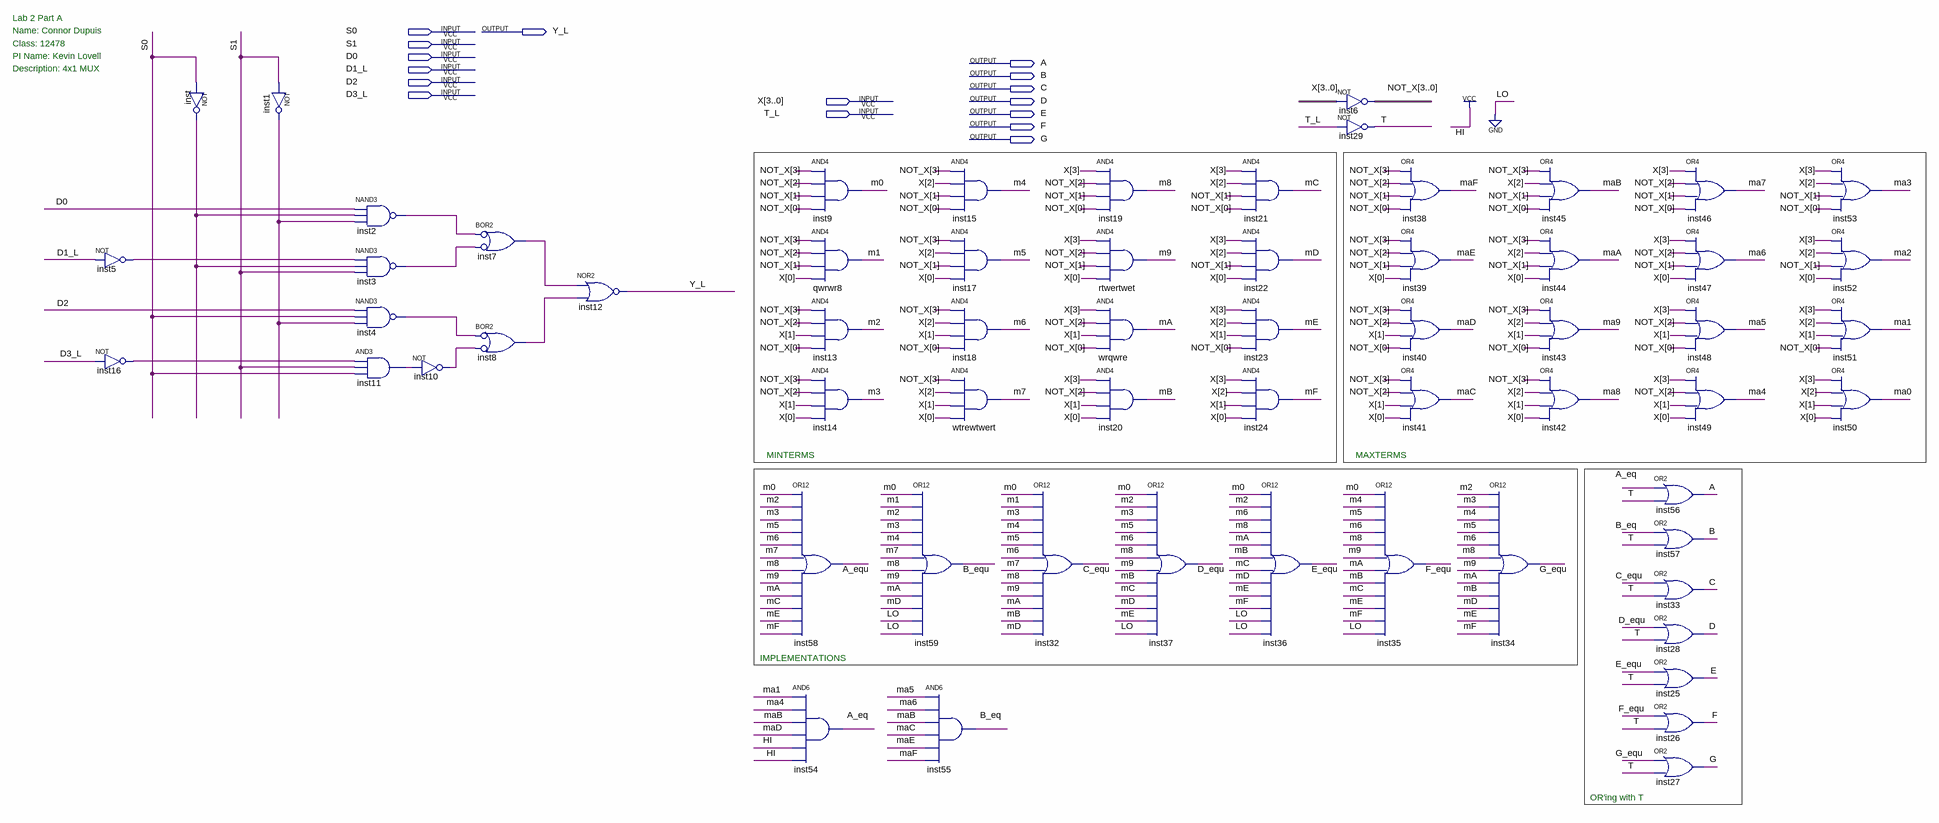
[diagram p0: schematic sheet]
// Quartus schematic Lab2_MUX.bdf as structural Verilog: 62 symbols, 16 pins
module Lab2_MUX (
  input  S0,
  input  S1,
  input  D0,
  input  D1_L,
  input  D2,
  input  D3_L,
  input  [3:0] X,
  input  T_L,
  output Y_L,
  output A,
  output B,
  output C,
  output D,
  output E,
  output F,
  output G
);

  wire A_eq, A_equ, B_eq, B_equ, C_equ, D_equ, E_equ, F_equ, G_equ, inst1_out, inst2_out, inst3_out,
       inst4_out, inst5_out, inst7_out, inst8_out, inst10_out, inst11_out, inst16_out, inst_out, m0, m1, m2,
       m3, m4, m5, m6, m7, m8, m9, mA, ma0, ma1, ma2, ma3, ma4, ma5, ma6, ma7, ma8, ma9, maA, maB, maC, maD,
       maE, maF, mB, mC, mD, mE, mF, T;
  wire [3:0] NOT_X;

  not inst5 (inst5_out, D1_L);
  not inst16 (inst16_out, D3_L);
  not inst (inst_out, S0);
  not inst1 (inst1_out, S1);
  nand inst2 (inst2_out, D0, inst_out, inst1_out);
  nand inst3 (inst3_out, inst5_out, inst_out, S1);
  nand inst4 (inst4_out, D2, S0, inst1_out);
  and inst11 (inst11_out, inst16_out, S1, S0);
  not inst10 (inst10_out, inst11_out);
  or inst7 (inst7_out, ~inst2_out, ~inst3_out);  // BOR2
  or inst8 (inst8_out, ~inst4_out, ~inst10_out);  // BOR2
  nor inst12 (Y_L, inst7_out, inst8_out);
  and inst9 (m0, NOT_X[3], NOT_X[2], NOT_X[1], NOT_X[0]);
  and qwrwr8 (m1, NOT_X[3], NOT_X[2], NOT_X[1], X[0]);
  and inst13 (m2, NOT_X[3], NOT_X[2], X[1], NOT_X[0]);
  and inst14 (m3, NOT_X[3], NOT_X[2], X[1], X[0]);
  or inst58 (A_equ, m0, m2, m3, m5, m6, m7, m8, m9, mA, mC, mE, mF);
  and inst54 (A_eq, ma1, ma4, maB, maD, 1'b1, 1'b1);
  or inst59 (B_equ, m0, m1, m2, m3, m4, m7, m8, m9, mA, mD, 1'b0, 1'b0);
  and inst15 (m4, NOT_X[3], X[2], NOT_X[1], NOT_X[0]);
  and inst17 (m5, NOT_X[3], X[2], NOT_X[1], X[0]);
  and inst18 (m6, NOT_X[3], X[2], X[1], NOT_X[0]);
  and wtrewtwert (m7, NOT_X[3], X[2], X[1], X[0]);
  and inst55 (B_eq, ma5, ma6, maB, maC, maE, maF);
  or inst32 (C_equ, m0, m1, m3, m4, m5, m6, m7, m8, m9, mA, mB, mD);
  and inst19 (m8, X[3], NOT_X[2], NOT_X[1], NOT_X[0]);
  and rtwertwet (m9, X[3], NOT_X[2], NOT_X[1], X[0]);
  and wrqwre (mA, X[3], NOT_X[2], X[1], NOT_X[0]);
  and inst20 (mB, X[3], NOT_X[2], X[1], X[0]);
  or inst37 (D_equ, m0, m2, m3, m5, m6, m8, m9, mB, mC, mD, mE, 1'b0);
  and inst21 (mC, X[3], X[2], NOT_X[1], NOT_X[0]);
  and inst22 (mD, X[3], X[2], NOT_X[1], X[0]);
  and inst23 (mE, X[3], X[2], X[1], NOT_X[0]);
  and inst24 (mF, X[3], X[2], X[1], X[0]);
  or inst36 (E_equ, m0, m2, m6, m8, mA, mB, mC, mD, mE, mF, 1'b0, 1'b0);
  assign NOT_X = ~X;  // NOT inst6, 4 bits wide
  not inst29 (T, T_L);
  or inst35 (F_equ, m0, m4, m5, m6, m8, m9, mA, mB, mC, mE, mF, 1'b0);
  or inst38 (maF, NOT_X[3], NOT_X[2], NOT_X[1], NOT_X[0]);
  or inst39 (maE, NOT_X[3], NOT_X[2], NOT_X[1], X[0]);
  or inst40 (maD, NOT_X[3], NOT_X[2], X[1], NOT_X[0]);
  or inst41 (maC, NOT_X[3], NOT_X[2], X[1], X[0]);
  or inst34 (G_equ, m2, m3, m4, m5, m6, m8, m9, mA, mB, mD, mE, mF);
  or inst45 (maB, NOT_X[3], X[2], NOT_X[1], NOT_X[0]);
  or inst44 (maA, NOT_X[3], X[2], NOT_X[1], X[0]);
  or inst43 (ma9, NOT_X[3], X[2], X[1], NOT_X[0]);
  or inst42 (ma8, NOT_X[3], X[2], X[1], X[0]);
  or inst56 (A, A_eq, T);
  or inst57 (B, B_eq, T);
  or inst33 (C, C_equ, T);
  or inst28 (D, D_equ, T);
  or inst25 (E, E_equ, T);
  or inst26 (F, F_equ, T);
  or inst27 (G, G_equ, T);
  or inst46 (ma7, X[3], NOT_X[2], NOT_X[1], NOT_X[0]);
  or inst47 (ma6, X[3], NOT_X[2], NOT_X[1], X[0]);
  or inst48 (ma5, X[3], NOT_X[2], X[1], NOT_X[0]);
  or inst49 (ma4, X[3], NOT_X[2], X[1], X[0]);
  or inst53 (ma3, X[3], X[2], NOT_X[1], NOT_X[0]);
  or inst52 (ma2, X[3], X[2], NOT_X[1], X[0]);
  or inst51 (ma1, X[3], X[2], X[1], NOT_X[0]);
  or inst50 (ma0, X[3], X[2], X[1], X[0]);

  // Notes on the sheet:
  //   Lab 2 Part A
  //   Name: Connor Dupuis
  //   Class: 12478
  //   PI Name: Kevin Lovell
  //   Description: 4x1 MUX
  //   MINTERMS
  //   MAXTERMS
  //   IMPLEMENTATIONS
  //   OR'ing with T
endmodule
